# Altium schematic sheet TVR_Rev2.SchDoc
size 635 x 241 mm; SheetNumber: 1; SheetTotal: 4
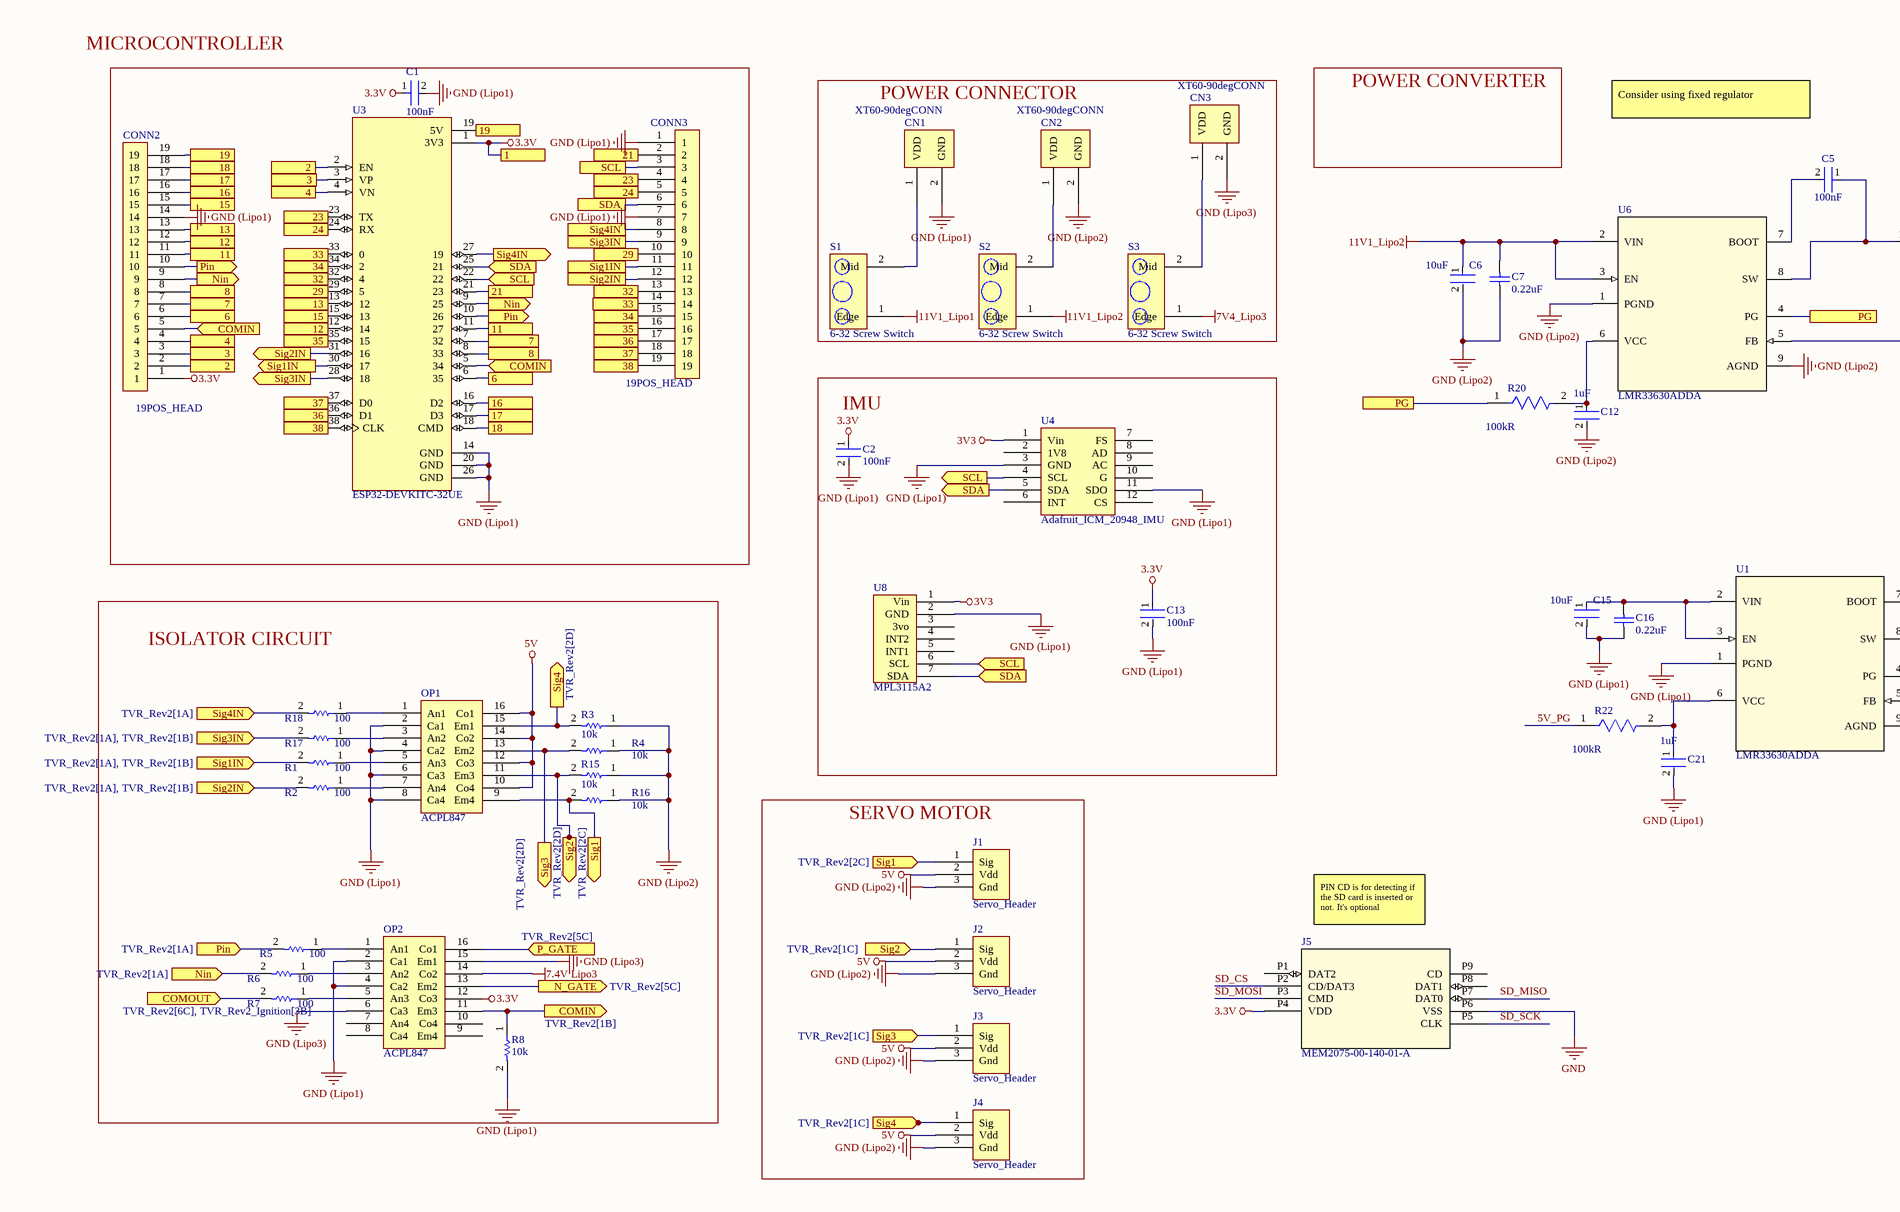
[diagram p0: TVR_Rev2.SchDoc, left]
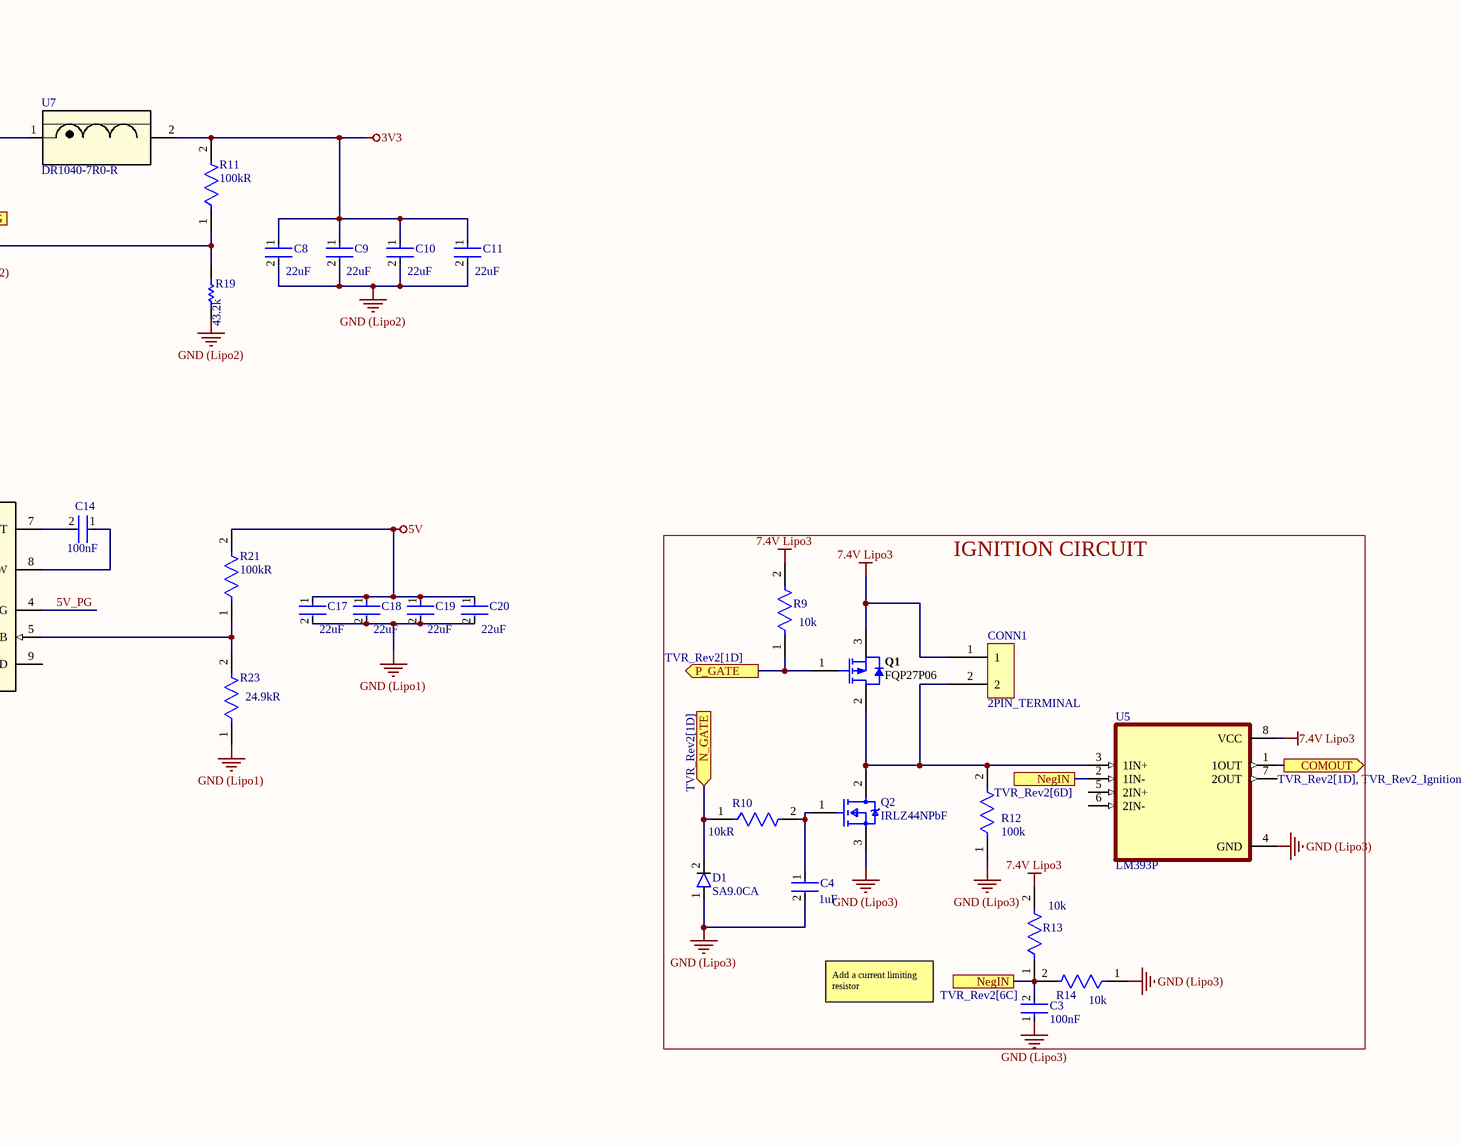
[diagram p1: TVR_Rev2.SchDoc, right]

## Parts
C1  100nF  [FP-RDE0M1-MFG]
C2  100nF  [FP-RDE0M1-MFG]
C3  100nF  [FP-RDE0M1-MFG]
C4  Capacitance: 1uF  [FP-1206-L_3_2_0_2-W_1_6_0-IPC_A]  (hidden comment: 12065C105KAT2A)
C5  Capacitance: 100nF  [FP-C2012-125-0_45-MFG]  (hidden comment: C2012X7T2E104K125AE)
C6  Capacitance: 10uF  [FP-GRM21B-0_15-IPC_C]  (hidden comment: GRM21BR61E106KA73L)
C7  0.22uF  [CAPC2013X94X50ML20T25]
C8  Capacitance: 22uF  [FP-CL21-IPC_A]  (hidden comment: CL21A226KOQNNNG)
C9  Capacitance: 22uF  [FP-CL21-IPC_A]  (hidden comment: CL21A226KOQNNNG)
C10  Capacitance: 22uF  [FP-CL21-IPC_A]  (hidden comment: CL21A226KOQNNNG)
C11  Capacitance: 22uF  [FP-CL21-IPC_A]  (hidden comment: CL21A226KOQNNNG)
C12  Capacitance: 1uF  [FP-C2012-125-IPC_B]  (hidden comment: C2012X7S2A105K125AE)
C13  100nF  [FP-RDE0M1-MFG]
C14  Capacitance: 100nF  [FP-C2012-125-0_45-MFG]  (hidden comment: C2012X7T2E104K125AE)
C15  Capacitance: 10uF  [FP-GRM21B-0_15-IPC_C]  (hidden comment: GRM21BR61E106KA73L)
C16  0.22uF  [CAPC2013X94X50ML20T25]
C17  Capacitance: 22uF  [FP-CL21-IPC_A]  (hidden comment: CL21A226KOQNNNG)
C18  Capacitance: 22uF  [FP-CL21-IPC_A]  (hidden comment: CL21A226KOQNNNG)
C19  Capacitance: 22uF  [FP-CL21-IPC_A]  (hidden comment: CL21A226KOQNNNG)
C20  Capacitance: 22uF  [FP-CL21-IPC_A]  (hidden comment: CL21A226KOQNNNG)
C21  Capacitance: 1uF  [FP-C2012-125-IPC_B]  (hidden comment: C2012X7S2A105K125AE)
CN1  XT60-90degCONN  [XT60-90CONN]
CN2  XT60-90degCONN  [XT60-90CONN]
CN3  XT60-90degCONN  [XT60-90CONN]
CONN1  2PIN_TERMINAL  [2PIN_TERMINAL]
CONN2  19POS_HEAD  [19POS_HEAD]
CONN3  19POS_HEAD  [19POS_HEAD]
D1  SA9.0CA  [SA9.0CA]
J1  Servo_Header  [ServoHeader]
J2  Servo_Header  [ServoHeader]
J3  Servo_Header  [ServoHeader]
J4  Servo_Header  [ServoHeader]
J5  MEM2075-00-140-01-A  [MEM2075-00-140-01-A_GCT]
OP1  ACPL847  [8PIN_DIP]
OP2  ACPL847  [8PIN_DIP]
Q1  FQP27P06  [FAIR-TO-220-3]
Q2  IRLZ44NPbF  [FP-PG-TO220-3-MFG]
R1  100  [RESC2013X50X30LL20T20]
R2  100  [RESC2013X50X30LL20T20]
R3  10k  [RESC2013X60X35NL10T20]
R4  10k  [RESC2013X60X35NL10T20]
R5  100  [RESC2013X50X30LL20T20]
R6  100  [RESC2013X50X30LL20T20]
R7  100  [RESC2013X50X30LL20T20]
R8  10k  [RESC2013X60X35NL10T20]
R9  10k  [FP-RLR07-MFG]
R10  Resistance: 10kR  [FP-CR1206-IPC_B]  (hidden comment: CR1206-JW-103ELF)
R11  Resistance: 100kR  [FP-RC0805-0_6-IPC_C]  (hidden comment: RC0805FR-07100KL)
R12  100k  [FP-RC0805-0_6-IPC_C]
R13  10k  [FP-RLR07-MFG]
R14  10k  [FP-RLR07-MFG]
R15  10k  [RESC2013X60X35NL10T20]
R16  10k  [RESC2013X60X35NL10T20]
R17  100  [RESC2013X50X30LL20T20]
R18  100  [RESC2013X50X30LL20T20]
R19  43.2k  [RESC2013X60X35NL10T20]
R20  Resistance: 100kR  [FP-RC0805-0_6-IPC_C]  (hidden comment: RC0805FR-07100KL)
R21  Resistance: 100kR  [FP-RC0805-0_6-IPC_C]  (hidden comment: RC0805FR-07100KL)
R22  Resistance: 100kR  [FP-RC0805-0_6-IPC_C]  (hidden comment: RC0805FR-07100KL)
R23  Resistance: 24.9kR  [FP-RMCF1210-MFG]  (hidden comment: RMCF1210FT24K9)
S1  6-32 Screw Switch  [6-32 Screw Switch]
S2  6-32 Screw Switch  [6-32 Screw Switch]
S3  6-32 Screw Switch  [6-32 Screw Switch]
U1  LMR33630ADDA  [DDA0008J]
U3  ESP32-DEVKITC-32UE  [ESPRESSIF_ESP32-DEVKITC-32UE]
U4  Adafruit_ICM_20948_IMU  [Adafruit_ICM_20948_IMU]
U5  LM393P  [DIP794W45P254L959H508Q8]
U6  LMR33630ADDA  [DDA0008J]
U7  DR1040-7R0-R  [DR1040-7R0-R_EAT]
U8  MPL3115A2  [MPL3115A2_DIP]

## Blocks framed on the sheet
POWER CONNECTOR: CN1-CN3 S1-S3
IMU: C2 C13 U4 U8
ISOLATOR CIRCUIT: OP1 OP2 R1-R8 R15-R18
IGNITION CIRCUIT: C3 C4 CONN1 D1 Q1 Q2 R9 R10 R12-R14 U5
SERVO MOTOR: J1-J4

## Ports
1, 2 (see TVR_Rev2[1A]), 2 (see TVR_Rev2[1B]), 3 (see TVR_Rev2[1A]), 3 (see TVR_Rev2[1B]), 4 (see TVR_Rev2[1A]), 4 (see TVR_Rev2[1B]), 6 (see TVR_Rev2[1A]), 6 (see TVR_Rev2[1B]), 7 (see TVR_Rev2[1A]), 7 (see TVR_Rev2[1B]), 8 (see TVR_Rev2[1A]), 8 (see TVR_Rev2[1B]), 11 (see TVR_Rev2[1A]), 11 (see TVR_Rev2[1B]), 12 (see TVR_Rev2[1A]), 12 (see TVR_Rev2[1B]), 13 (see TVR_Rev2[1A]), 15 (see TVR_Rev2[1A]), 16 (see TVR_Rev2[1A]), 16 (see TVR_Rev2[1B]), 17 (see TVR_Rev2[1A]), 17 (see TVR_Rev2[1B]), 18 (see TVR_Rev2[1A]), 18 (see TVR_Rev2[1B]), 19 (see TVR_Rev2[1A]), 21 (see TVR_Rev2[1A]), 21 (see TVR_Rev2[2A]), 23 (see TVR_Rev2[1A]), 23 (see TVR_Rev2[2A]), 24 (see TVR_Rev2[1A]), 24 (see TVR_Rev2[2A]), 29 (see TVR_Rev2[1A]), 29 (see TVR_Rev2[2A]), 32 (see TVR_Rev2[1A]), 32 (see TVR_Rev2[2A]), 33 (see TVR_Rev2[1A]), 33 (see TVR_Rev2[2A]), 34 (see TVR_Rev2[1A]), 34 (see TVR_Rev2[2A]), 35 (see TVR_Rev2[1B]), 35 (see TVR_Rev2[2B]), 36 (see TVR_Rev2[1B]), 36 (see TVR_Rev2[2B]), 37 (see TVR_Rev2[1B]), 37 (see TVR_Rev2[2B]), 38 (see TVR_Rev2[1B]), 38 (see TVR_Rev2[2B]), COMIN (in, see TVR_Rev2[1B], TVR_Rev2[1D]), COMIN (out, see TVR_Rev2[1B]), COMOUT (in, see TVR_Rev2[6C], TVR_Rev2_Ignition[3B]), COMOUT (out, see TVR_Rev2[1D], TVR_Rev2_Ignition[3B]), N_GATE (in, see TVR_Rev2[1D]), N_GATE (out, see TVR_Rev2[5C]), NegIN (see TVR_Rev2[6C]), NegIN (see TVR_Rev2[6D]), Nin (in, see TVR_Rev2[1A]), Nin (out, see TVR_Rev2[1A], TVR_Rev2[1D]), P_GATE (in, see TVR_Rev2[5C]), P_GATE (out, see TVR_Rev2[1D]), PG (see TVR_Rev2[3B], TVR_Rev2_Power[2B]), PG (see TVR_Rev2[4A], TVR_Rev2_Power[2B]), Pin (in, see TVR_Rev2[1A]), Pin (out, see TVR_Rev2[1A], TVR_Rev2[1D]), SCL (in, see TVR_Rev2[1A], TVR_Rev2[2A], TVR_Rev2[2B]), SCL (in, see TVR_Rev2[2A], TVR_Rev2[2B], TVR_Rev2[2C]), SCL (out, see TVR_Rev2[1A], TVR_Rev2[2A], TVR_Rev2[2C]), SCL (see TVR_Rev2[1A], TVR_Rev2[2B], TVR_Rev2[2C]), SDA (in, see TVR_Rev2[1A], TVR_Rev2[2A], TVR_Rev2[2B]), SDA (in, see TVR_Rev2[2A], TVR_Rev2[2B], TVR_Rev2[2C]), SDA (out, see TVR_Rev2[1A], TVR_Rev2[2A], TVR_Rev2[2C]), SDA (see TVR_Rev2[1A], TVR_Rev2[2B], TVR_Rev2[2C]), Sig1 (in, see TVR_Rev2[2C]), Sig1 (out, see TVR_Rev2[2C]), Sig1IN (in, see TVR_Rev2[1A], TVR_Rev2[1B]), Sig1IN (out, see TVR_Rev2[1A], TVR_Rev2[1C]), Sig1IN (see TVR_Rev2[1B], TVR_Rev2[1C]), Sig2 (in, see TVR_Rev2[1C]), Sig2 (out, see TVR_Rev2[2D]), Sig2IN (in, see TVR_Rev2[1A], TVR_Rev2[1B]), Sig2IN (out, see TVR_Rev2[1A], TVR_Rev2[1C]), Sig2IN (see TVR_Rev2[1B], TVR_Rev2[1C]), Sig3 (in, see TVR_Rev2[1C]), Sig3 (out, see TVR_Rev2[2D]), Sig3IN (in, see TVR_Rev2[1A], TVR_Rev2[1B]), Sig3IN (out, see TVR_Rev2[1A], TVR_Rev2[1C]), Sig3IN (see TVR_Rev2[1B], TVR_Rev2[1C]), Sig4 (in, see TVR_Rev2[1C]), Sig4 (out, see TVR_Rev2[2D]), Sig4IN (in, see TVR_Rev2[1A]), Sig4IN (out, see TVR_Rev2[1A], TVR_Rev2[1C]), Sig4IN (see TVR_Rev2[1A], TVR_Rev2[1C])

## Nets
3.3V: C1.1 C2.1 C13.1 CONN2.1 J5.P4(VDD) OP2.12(Co3) U3.1(3V3) ; port 1
3V3: C8.1 C9.1 C10.1 C11.1 R11.2 U4.1(Vin) U7.2 U8.1(Vin)
5V: C17.1 C18.1 C19.1 C20.1 J1.2(Vdd) J2.2(Vdd) J3.2(Vdd) J4.2(Vdd) OP1.10(Co4) OP1.12(Co3) OP1.14(Co2) OP1.16(Co1) R21.2
7.4V Lipo3: CONN1.1 OP2.14(Co2) Q1.3(S) R9.2 R13.2 U5.8(VCC)
7V4_Lipo3: S3.1(Edge)
11V1_Lipo1: S1.1(Edge)
11V1_Lipo2: C6.1 C7.2 S2.1(Edge) U6.2(VIN) U6.3(EN)
GND: J5.P6(VSS)
GND (Lipo1): C1.2 C2.2 C13.2 C15.2 C16.1 C17.2 C18.2 C19.2 C20.2 C21.2 CN1.2(GND) CONN2.14 CONN3.1 CONN3.7 OP1.2(Ca1) OP1.4(Ca2) OP1.6(Ca3) OP1.8(Ca4) OP2.2(Ca1) OP2.4(Ca2) R8.2 R23.1 U1.1(PGND) U3.14(GND) U3.20(GND) U3.26(GND) U4.3(GND) U4.11(SDO) U8.2(GND)
GND (Lipo2): C6.2 C7.1 C8.2 C9.2 C10.2 C11.2 C12.2 CN2.2(GND) J1.3(Gnd) J2.3(Gnd) J3.3(Gnd) J4.3(Gnd) R3.1 R4.1 R15.1 R16.1 R19.1 U6.1(PGND) U6.9(AGND)
GND (Lipo3): C3.1 C4.2 CN3.2(GND) D1.1 OP2.6(Ca3) OP2.15(Em1) Q2.3(S) R12.1 R14.1 U5.4(GND)
2: CONN2.2 U3.2(EN) ; port 2
3: CONN2.3 U3.3(VP) ; port 3
4: CONN2.4 U3.4(VN) ; port 4
5V_PG: R22.1 U1.4(PG)
6: CONN2.6 U3.6(35) ; port 6
7: CONN2.7 U3.7(32) ; port 7
8: CONN2.8 U3.8(33) ; port 8
11: CONN2.11 U3.11(27) ; port 11
12: CONN2.12 U3.12(14) ; port 12
13: CONN2.13 U3.13(12) ; port 13
15: CONN2.15 U3.15(13) ; port 15
16: CONN2.16 U3.16(D2) ; port 16
17: CONN2.17 U3.17(D3) ; port 17
18: CONN2.18 U3.18(CMD) ; port 18
19: CONN2.19 U3.19(5V) ; port 19
21: CONN3.2 U3.21(23) ; port 21
23: CONN3.4 U3.23(TX) ; port 23
24: CONN3.5 U3.24(RX) ; port 24
29: CONN3.10 U3.29(5) ; port 29
32: CONN3.13 U3.32(4) ; port 32
33: CONN3.14 U3.33(0) ; port 33
34: CONN3.15 U3.34(2) ; port 34
35: CONN3.16 U3.35(15) ; port 35
36: CONN3.17 U3.36(D1) ; port 36
37: CONN3.18 U3.37(D0) ; port 37
38: CONN3.19 U3.38(CLK) ; port 38
COMIN: CONN2.5 OP2.11(Em3) R8.1 U3.5(34) ; port COMIN
COMOUT: R7.2 U5.1(1OUT) ; port COMOUT
N_GATE: D1.2 OP2.13(Em2) R10.1 ; port N_GATE
NegIN: C3.2 R13.1 R14.2 U5.2(1IN-) ; port NegIN
Nin: CONN2.9 R6.2 U3.9(25) ; port Nin
P_GATE: OP2.16(Co1) Q1.1(G) R9.1 ; port P_GATE
PG: R20.1 U6.4(PG) ; port PG
Pin: CONN2.10 R5.2 U3.10(26) ; port Pin
SCL: CONN3.3 U3.22 U4.4(SCL) U8.6(SCL) ; port SCL
SD_CS: J5.P2(CD/DAT3)
SD_MISO: J5.P7(DAT0)
SD_MOSI: J5.P3(CMD)
SD_SCK: J5.P5(CLK)
SDA: CONN3.6 U3.25(21) U4.5(SDA) U8.7(SDA) ; port SDA
Sig1: J1.1(Sig) OP1.9(Em4) R16.2 ; port Sig1
Sig1IN: CONN3.11 R1.2 U3.30(17) ; port Sig1IN
Sig2: J2.1(Sig) OP1.11(Em3) R15.2 ; port Sig2
Sig2IN: CONN3.12 R2.2 U3.31(16) ; port Sig2IN
Sig3: J3.1(Sig) OP1.13(Em2) R4.2 ; port Sig3
Sig3IN: CONN3.9 R17.2 U3.28(18) ; port Sig3IN
Sig4: J4.1(Sig) OP1.15(Em1) R3.2 ; port Sig4
Sig4IN: CONN3.8 R18.2 U3.27(19) ; port Sig4IN
NetC4_1: C4.1 Q2.1(G) R10.2
NetC5_1: C5.1 U6.8(SW) U7.1
NetC5_2: C5.2 U6.7(BOOT)
NetC12_1: C12.1 R20.2 U6.6(VCC)
NetC14_1: C14.1 U1.8(SW)
NetC14_2: C14.2 U1.7(BOOT)
NetC15_1: C15.1 C16.2 U1.2(VIN) U1.3(EN)
NetC21_1: C21.1 R22.2 U1.6(VCC)
NetCN1_1: CN1.1(VDD) S1.2(Mid)
NetCN2_1: CN2.1(VDD) S2.2(Mid)
NetCN3_1: CN3.1(VDD) S3.2(Mid)
NetCONN1_2: CONN1.2 Q1.2(D) Q2.2(D) R12.2 U5.3(1IN+)
NetOP1_1: OP1.1(An1) R18.1
NetOP1_3: OP1.3(An2) R17.1
NetOP1_5: OP1.5(An3) R1.1
NetOP1_7: OP1.7(An4) R2.1
NetOP2_1: OP2.1(An1) R5.1
NetOP2_3: OP2.3(An2) R6.1
NetOP2_5: OP2.5(An3) R7.1
NetR11_1: R11.1 R19.2 U6.5(FB)
NetR21_1: R21.1 R23.2 U1.5(FB)

Not connected (* = marked no-connect by the designer): J5 P1(DAT2) P8(DAT1) P9(CD); OP2 7(An4) 8(Ca4) 9(Em4) 10(Co4); U1 9(AGND); U4 2(1V8) 6(INT) 7(FS) 8(AD) 9(AC) 10(G) 12(CS); U5 5(2IN+) 6(2IN-) 7(2OUT); U8 3(3vo) 4(INT2) 5(INT1)

## Notes on the sheet
- MICROCONTROLLER
- POWER CONVERTER
- Consider using fixed regulator
- PIN CD is for detecting if the SD card is inserted or not. It's optional
- Add a current limiting resistor

## Library data of the parts
C1-C3 C13 = CMP-06035-051680-1: Ceramic Capacitor 100nF ±10% 50V X7R Radial; Lead/Base Style: Kinked; Lead Diameter: 0.5mm; Lead Free: Lead Free; Mount: Through Hole; Package Quantity: 2000; Lead Pitch: 0.197inch; Capacitance: 100nF; Case/Package: Radial; Tolerance: 10%; Height - Seated (Max): 0.236inch; Max Operating Temperature: 125°C; Dielectric: X7R; Min Operating Temperature: -55°C; Voltage Rating (DC): 50V; Voltage Rating: 50V; Termination: Radial; Height: 3.5mm; Resistor Type: Ceramic; Width: 3.5mm; Packaging: Tape and Reel; Length: 0.157inch
C4 = CMP-2000-05866-2: General Purpose Ceramic Capacitor, 1206, 1uF, 10%, X7R, 15%, 50V; Dissipation Factor: 2.5%; Voltage: 25V; Dielectric: X7R; Radiation Hardening: No; Number of Pins: 2; Package Quantity: 1; Case Code (Metric): 3216; Thickness: 0.07inch; Voltage Rating (DC): 50V; Width: 0.063inch; Construction: Flat; Min Operating Temperature: -55°C; Length: 3.2mm; Voltage Rating: 50V; Case Code (Imperial): 1206; Height: 1.78mm; REACH SVHC: No SVHC; Mount: Surface Mount; Max Operating Temperature: 125°C; Depth: 1.6mm; Packaging: Tape and Reel; Tolerance: 10%; Lead Free: Lead Free; Termination: SMD/SMT; RoHS Compliant: Yes; Case/Package: 1206; Contact Plating: Tin; Series: -
C5 C14 = CMP-08246-004341-1: CAP CER 0.1UF 250V X7T 0805; Tolerance: 10%; Case Code (Metric): 2012; Package Quantity: 1; Max Operating Temperature: 125°C; Thickness: 0.049inch; Case Code (Imperial): 0805; Features: Soft Termination; Length: 2mm; Weight: 0.000194oz; Min Operating Temperature: -55°C; Case/Package: 0805; Mount: Surface Mount; REACH SVHC: No SVHC; Dielectric: X7T; Voltage Rating: 250V; Width: 0.05inch; Series: C; Packaging: Tape and Reel; Depth: 1.25mm; Resistor Type: Ceramic; Voltage Rating (DC): 250V; Height: 1.25mm; Termination: SMD/SMT; RoHS Compliant: Yes
C6 C15 = CMP-2007-03541-2: Chip Multilayer Ceramic Capacitors for General Purpose, 0805, 10uF, X5R, 15%, 10%, 25V; Length: 2mm; Depth: 1.25mm; Termination: SMD/SMT; Voltage: 25V; Height: 1.25mm; Material: Ceramic; Thickness: 0.053inch; Radiation Hardening: No; Min Operating Temperature: -55°C; Width: 0.049inch; Package Quantity: 1; Mount: Surface Mount; Dielectric: X5R; Packaging: Tape and Reel; Voltage Rating (DC): 25V; Lead Free: Lead Free; Max Operating Temperature: 85°C; Case Code (Imperial): 0805; Case/Package: 0805; Tolerance: 10%; Voltage Rating: 25V; Case Code (Metric): 2012
C7 C16 = CMP-2007-04189-1: Part Number: 08051C224KAT2A; Manufacturer: AVX Interconnect / Elco
C8-C11 C17-C20 = CMP-13271-000211-1: CL21 Series 0805 22uF 16V ±10% Tolerance X5R Multilayer Ceramic Chip Capacitor; Max Operating Temperature: 85°C; Width: 0.049inch; Tolerance: 10%; Thickness: 0.055inch; Mount: Surface Mount; Case/Package: 0805; Lead Free: Lead Free; Packaging: Tape and Reel; Voltage Rating: 16V; Package Quantity: 3000; Min Operating Temperature: -55°C; Length: 0.079inch
C12 C21 = CMP-08246-004333-1: CAP CER 1UF 100V X7S 0805; Tolerance: 10%; Case Code (Metric): 2012; Resistor Type: Ceramic; Voltage Rating (DC): 100V; RoHS Compliant: Yes; Mount: Surface Mount; Min Operating Temperature: -55°C; Voltage Rating: 100V; Series: C; Width: 0.05inch; Max Operating Temperature: 125°C; Height: 1.25mm; Length: 2mm; Dielectric: X7S; Case/Package: 0805; Packaging: Tape and Reel; Features: Soft Termination; Lead Free: Lead Free; Case Code (Imperial): 0805; Thickness: 0.049inch; Termination: SMD/SMT; Package Quantity: 1; Depth: 1.25mm
J5 = MEM2075-00-140-01-A: No Description Available; Mfr_Name: Global Connector Technology; RefDes: RefDes; Type: Type
Q1 = CMP-2000-04936-1: P-Channel QFET(R) MOSFET, -60 V, -27 A, -55 to 175 degC, 3-Pin TO-220, RoHS, Tube; Manufacturer: Fairchild; Rated Power Dissipation: 120W; Qg Gate Charge: 33nC; Drain-Source On Resistance-Max: 0.07O; Drain-to-Source Voltage [Vdss]: 60V; Package Reference: TO-220; Datasheet URL: https://www.fairchildsemi.com/datasheets/FQ/FQP27P06.pdf; Datasheet Version: Mar-13; Package Description: 3-Pin Through Hole Device, Body 10 x 4.5 mm, Pitch 2.54 mm; Package URL: https://www.fairchildsemi.com/package-drawings/TO/TO220B03.pdf; Channel Type: P-Channel; Manufacturer URL: https://www.fairchildsemi.com/
Q2 = CMP-32901-000488-1: MOSFET N-CH 55V 47A TO220AB; Turn-On Delay Time: 11ns; Gate to Source Voltage (Vgs): 16V; Element Configuration: Single; Rds On Max: 22mR; Turn-Off Delay Time: 26ns; Max Power Dissipation: 110W; Threshold Voltage: 2V; Drain to Source Resistance: 35mR; Input Capacitance: 1.7nF; Continuous Drain Current (ID): 47A; Case/Package: TO-220; Lead Free: Lead Free; Halogen Free: Halogen Free; Packaging: Rail/Tube; Length: 0.414inch; Min Operating Temperature: -55°C; REACH SVHC: No SVHC; Number of Pins: 3; Width: 0.185inch; Drain to Source Voltage (Vdss): 55V; Power Dissipation: 110W; RoHS Compliant: Yes; Max Operating Temperature: 175°C; Height: 0.6inch; Max Dual Supply Voltage: 55V; Drain to Source Breakdown Voltage: 55V; Mount: Through Hole
R1 R2 R5-R7 R17 R18 = CMP-2001-04901-1: Manufacturer: Vishay Dale; Part Number: CRCW0805100RFKEA
R3 R4 R8 R15 R16 = CMP-1659-00013-4: Chip Resistor, 10 KOhm, +/- 1%, 0.125 W, -55 to 155 degC, 0805 (2012 Metric), RoHS, Tape and Reel; Manufacturer: Yageo; Voltage Rating: 150 V; Mount: Surface Mount; ComponentLink1Description: Manufacturer URL; ComponentLink2URL: http://www.yageo.com/documents/recent/PYu-RC_Group_51_RoHS_L_04.pdf; Pins: 2; Length: 2 mm; Min Operating Temperature: -55 degC; Height: 0.5 mm; Mounting Technology: Surface Mount; RoHSCompliant: true; REACH SVHC: No SVHC; ComponentLink1URL: http://www.yageo.com/; Max Operating Temperature: 155 degC; PackageReference: 0805; DatasheetVersion: Rev. 4, 02/2016; Package Quantity: 5000; Packaging: Tape and Reel; ComponentLink2Description: Datasheet; PackageDescription: 2-Pin Surface Mounted Device, Body 2 x 1.25 mm
R9 R13 R14 = CMP-00030-39447724-1: RLR07C1001FSB14 Fixed Resistor, Metal Film, 0.25W, 1000ohm, 250V, 1% +/-Tol, 100ppm/Cel, Through Hole Mount; Wire/Cable Diameter: 50.8µm; Lead Diameter: 640µm; Max Power Dissipation: 250mW; Temperature Coefficient: 100ppm/°C; Resistance: 1kΩ; Lead Length: 38.1mm; Voltage Rating: 250V; Lead Free: Contains Lead; REACH SVHC: Unknown; Packaging: Bulk; Military Standard: MIL-PRF-39017; Width: 2.29mm; Max Operating Temperature: 150°C; Length: 7.62mm; Min Operating Temperature: -65°C; Composition: Metal Film; Diameter: 2.29mm; Radiation Hardening: No; Features: Military, Moisture Resistant, Weldable; Failure Rate: 0.001%; Case/Package: Conformal; Tolerance: 1%; Voltage Rating (DC): 250V; Schedule B: 8533210090, 8533210090; RoHS: Non-Compliant; Termination: Axial; Power Rating: 250mW; Contact Plating: Lead, Tin; NexarPartId: 39447724; Number of Terminations: 2; Number of Pins: 14
R10 = CMP-07231-005593-1: Thick Film Chip Resistors 1206 10kΩ 0.25W 5% 200ppm/°C; Voltage Rating: 200V; Max Power Dissipation: 250mW; Temperature Coefficient: 200ppm/°C; Height: 0.6mm; Case Code (Imperial): 1206; REACH SVHC: No SVHC; Depth: 1.6mm; Mount: Surface Mount; Termination: SMD/SMT; Case/Package: 1206; Min Operating Temperature: -55°C; Features: Moisture Resistant; Number of Pins: 2; Length: 3.2mm; Military Standard: Not; Radiation Hardening: No; Max Operating Temperature: 155°C; Power Rating: 250mW; Case Code (Metric): 3216; Package Quantity: 1; Composition: Thick Film; Tolerance: 5%; Voltage Rating (DC): 200V; Contact Plating: Tin; Thickness: 610um; Number of Terminations: 2; Packaging: Tape and Reel; Width: 1.6mm
R11 R20-R22 = CMP-2100-03668-5: RES 100K OHM 1% 1/8W 0805; Power Rating: 125mW; Temperature Coefficient: 100ppm/°C; Voltage Rating (DC): 150V; Package Quantity: 1; Case/Package: 0805; Lead Pitch: 0.4mm; Case Code (Imperial): 0805; Construction: Rectangular; Number of Terminations: 2; RoHS Compliant: Yes; Max Power Dissipation: 125mW; Tolerance: 1%; Max Operating Temperature: 155°C; Resistance Tolerance: 1%; Lead Free: Lead Free; Packaging: Tape and Reel; Resistor Type: Thick Film; Min Operating Temperature: -55°C; Case Code (Metric): 2012; Series: RC; Technology: THICK FILM; Voltage Rating: 150V; Termination: SMD/SMT; Width: 0.049inch; Number of Pins: 2; Features: Moisture Resistant; Military Standard: Not; Length: 0.079inch; Depth: 1.25mm; Size Code: 0805; Height: 0.024inch
R12 = CMP-2100-03668-5: RES 100K OHM 1% 1/8W 0805; Power Rating: 125mW; Temperature Coefficient: 100ppm/°C; Voltage Rating (DC): 150V; Resistance: 100kR; Package Quantity: 1; Case/Package: 0805; Lead Pitch: 0.4mm; Case Code (Imperial): 0805; Construction: Rectangular; Number of Terminations: 2; RoHS Compliant: Yes; Max Power Dissipation: 125mW; Tolerance: 1%; Max Operating Temperature: 155°C; Resistance Tolerance: 1%; Lead Free: Lead Free; Packaging: Tape and Reel; Resistor Type: Thick Film; Min Operating Temperature: -55°C; Case Code (Metric): 2012; Series: RC; Technology: THICK FILM; Voltage Rating: 150V; Termination: SMD/SMT; Width: 0.049inch; Number of Pins: 2; Features: Moisture Resistant; Military Standard: Not; Length: 0.079inch; Depth: 1.25mm; Size Code: 0805; Height: 0.024inch
R19 = CMP-2001-01147-1: Manufacturer: Yageo; Part Number: RC0805FR-0743K2L
R23 = CMP-26527-004872-1: 24.9kΩ ±1% 0.5W 1210 Thick Film Chip Resistor AEC-Q200 compliant; Temperature Coefficient: 100ppm/°C; Max Power Dissipation: 333mW; Length: 0.126inch; Mount: Surface Mount; Width: 0.098inch; Resistor Type: Thick Film; Packaging: Tape and Reel; RoHS Compliant: Yes; Series: RMCF; Max Operating Temperature: 155°C; Case/Package: 1210; Radiation Hardening: No; Number of Terminations: 2; Contact Plating: Tin; Case Code (Metric): 3225; Features: Automotive AEC-Q200; Height: 0.028inch; Tolerance: 1%; Package Quantity: 1; Min Operating Temperature: -55°C; Case Code (Imperial): 1210
U1 U6 = LMR33630ADDA: No Description Available; Mfr_Name: Texas Instruments; TYPE: TYPE; RefDes: RefDes
U3 = ESP32-DEVKITC-32UE: ESP32-WROOM-32UE series Transceiver; 802.11 b/g/n (Wi-Fi, WiFi, WLAN), BluetoothÂ® Smart Ready 4.x Dual Mode Evaluation Board; MF: Espressif Systems; Package: None; Price: None; MP: ESP32-DEVKITC-32UE; Availability: In Stock; Value: *; Check_prices: https://www.snapeda.com/parts/ESP32-DEVKITC-32UE/Espressif+Systems/view-part/?ref=eda; Purchase-URL: https://pricing.snapeda.com/search/part/ESP32-DEVKITC-32UE/?ref=eda; SnapEDA_Link: https://www.snapeda.com/parts/ESP32-DEVKITC-32UE/Espressif+Systems/view-part/?ref=snap
U5 = LM393P: Dual differential comparator, commercial grade 8-PDIP 0 to 70; MF: Texas Instruments; Availability: Unavailable; Value: *; Texas_Instruments-Purchase-URL: https://snapeda.com/shop?store=Texas+Instruments&id=46802; Package: PDIP-8 Texas Instruments; Price: None; SnapEDA_Link: https://www.snapeda.com/parts/LM393P/Texas%20Instruments/view-part/46802/?ref=snap; MP: LM393P; BuyPart: https://www.snapeda.com/parts/LM393P/Texas%20Instruments/view-part/46802/?ref=eda
U7 = DR1040-7R0-R: No Description Available; Mfr_Name: Eaton / Coiltronics; RefDes: RefDes; Type: Type